# EAGLE design myschem (EAGLE 7.5.0)
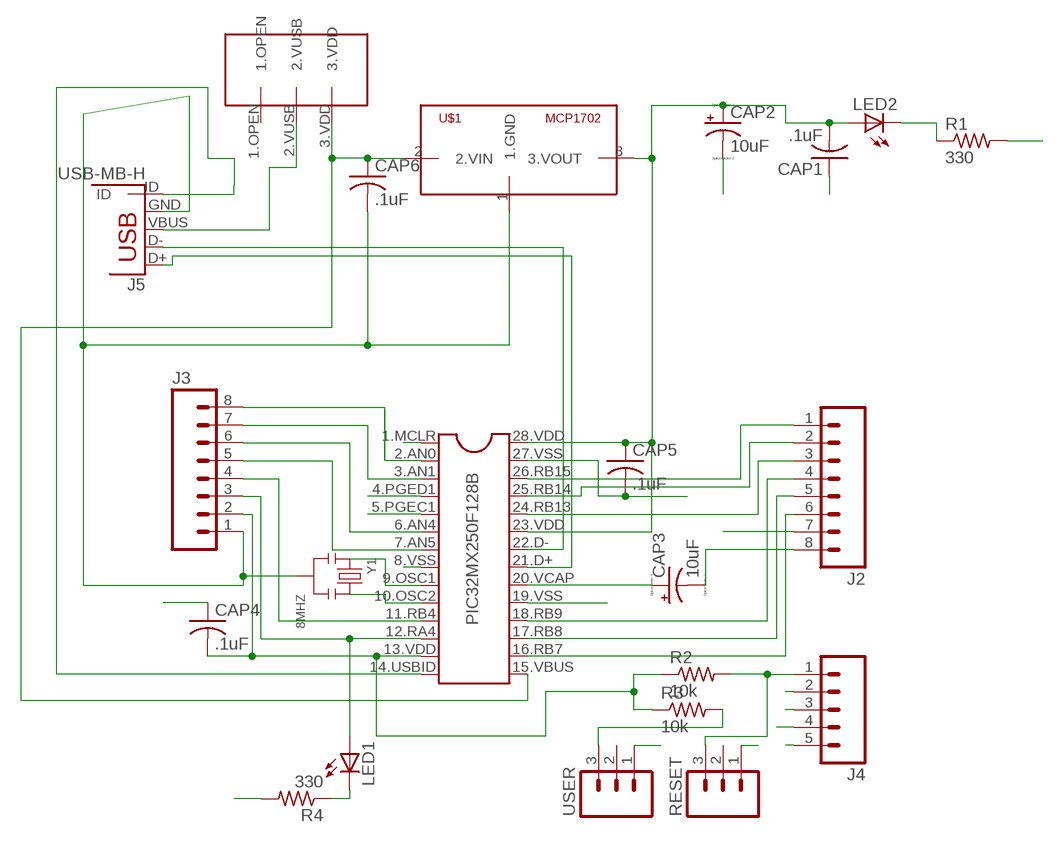
[diagram p0: schematic, sheet 1]

## Parts
CAP1  .1uF  C-US025-024X044  [C025-024X044]
CAP2  10uF  CPOL-USB45181B  [B45181B]
CAP3  10uF  CPOL-USB45181B  [B45181B]
CAP4  .1uF  C-US025-024X044  [C025-024X044]
CAP5  .1uF  C-US025-024X044  [C025-024X044]
CAP6  .1uF  C-US025-024X044  [C025-024X044]
J2  M08  [1X08_ROUND]
J3  M08  [1X08_ROUND]
J4  M05PTH  [1X05]
J5  USB-MB-H  [USB-MB-H]
LED1  LED3MM  [LED3MM]
LED2  LED3MM  [LED3MM]
PIC32MX250F128B  DIL28-3  [DIL28-3]
R1  330  R-US_0207/10  [0207/10]
R2  10k  R-US_0207/10  [0207/10]
R3  10k  R-US_0207/10  [0207/10]
R4  330  R-US_0207/10  [0207/10]
RESET  M03PTH  [1X03]
U$1  MCP1702  [TO92]
U$2  SLIDE-SWTICH  [SLIDE-SWITCH]
USER  M03PTH  [1X03]
Y1  8MHZ  DIP-CERAMIC-RESONATOR/-OSCILLATOR-8MHZ(3P-2.5-8X3MM)  [X3-2.5-8X3X5.5MM]

## Nets
GND: CAP1.1 CAP2.- CAP3.- CAP4.1 CAP5.2 CAP6.2 J2.8 J3.1 J4.3 J5.GND PIC32MX250F128B.8.VSS PIC32MX250F128B.19.VSS PIC32MX250F128B.27.VSS R1.2 R4.2 RESET.1 U$1.1(1.GND) USER.1 Y1.2
MCLR: J4.1 PIC32MX250F128B.1.MCLR R2.2 RESET.3
N$1: J3.8 PIC32MX250F128B.2.AN0
N$2: J3.7 PIC32MX250F128B.3.AN1
N$3: J3.6 PIC32MX250F128B.6.AN4
N$4: J3.5 PIC32MX250F128B.7.AN5
N$5: J5.D- PIC32MX250F128B.22.D-
N$6: J5.D+ PIC32MX250F128B.21.D+
N$7: J3.3 LED1.A PIC32MX250F128B.12.RA4
N$8: J5.ID PIC32MX250F128B.14.USBID
N$9: PIC32MX250F128B.9.OSC1 Y1.1
N$10: PIC32MX250F128B.10.OSC2 Y1.3
N$11: LED2.K(C) R1.1
N$12: J5.VBUS U$2.2.VUSB
N$14: J2.6 PIC32MX250F128B.16.RB7
N$15: LED1.K(C) R4.1
N$17: J2.1 PIC32MX250F128B.26.RB15
N$18: J2.2 PIC32MX250F128B.25.RB14
N$19: J2.3 PIC32MX250F128B.24.RB13
N$20: J2.4 PIC32MX250F128B.18.RB9
N$21: J2.5 PIC32MX250F128B.17.RB8
N$22: CAP3.+ PIC32MX250F128B.20.VCAP
PGEC1: J4.5 PIC32MX250F128B.5.PGEC1
PGED1: J4.4 PIC32MX250F128B.4.PGED1
USER: J3.4 PIC32MX250F128B.11.RB4 R3.2 USER.3
VBUS: CAP6.1 J2.7 PIC32MX250F128B.15.VBUS U$1.2(2.VIN) U$2.3.VDD
VDD: CAP1.2 CAP2.+ CAP4.2 CAP5.1 J3.2 J4.2 LED2.A PIC32MX250F128B.13.VDD PIC32MX250F128B.23.VDD PIC32MX250F128B.28.VDD R2.1 R3.1 U$1.3(3.VOUT)
Unconnected: RESET.2 U$2.1.OPEN USER.2

## Library data of the parts
CAP1 CAP4-CAP6 = mylib:C-US: CAPACITOR, American symbol
CAP2 CAP3 = mylib:CPOL-US: POLARIZED CAPACITOR, American symbol
J2 J3 = mylib:M08: Header 8 Standard 8-pin 0.1" header. Use with straight break away headers (SKU : PRT-00116), right angle break away headers (PRT-00553), swiss pins (PRT-00743), machine pins (PRT-00117), and female headers (PRT-00115).; PROD_ID: CONN-08437
J4 = mylib:M05: Header 5 Standard 5-pin 0.1" header. Use with straight break away headers (SKU : PRT-00116), right angle break away headers (PRT-00553), swiss pins (PRT-00743), machine pins (PRT-00117), and female headers (PRT-00115). Molex polarized connector foot print use with SKU : PRT-08230 with associated crimp pins and housings.
J5 = mylib:USB: USB Connectors USB-B-PTH is fully proven SKU : PRT-00139/CONN-08278 USB-miniB is fully proven SKU : PRT-00587 USB-A-PCB is untested. USB-A-H is throughly reviewed, but untested. Spark Fun Electronics SKU : PRT-00437 USB-B-SMT is throughly reviewed, but untested. Needs silkscreen touching up. USB-A-S has not been used/tested USB-MB-H has not been used/tested USB-MICROB has been used. CONN-09505
LED1 LED2 = mylib:LED: LED OSRAM: - CHIPLED LG R971, LG N971, LY N971, LG Q971, LY Q971, LO R971, LY R971 LH N974, LH R974 LS Q976, LO Q976, LY Q976 LO Q996 - Hyper CHIPLED LW Q18S LB Q993, LB Q99A, LB R99A - SideLED LS A670, LO A670, LY A670, LG A670, LP A670 LB A673, LV A673, LT A673, LW A673 LH A674 LY A675 LS A676, LA A676, LO A676, LY A676, LW A676 LS A679, LY A679, LG A679 - Hyper Micro SIDELED® LS Y876, LA Y876, LO Y876, LY Y876 LT Y87S - SmartLED LW L88C, LW L88S LB L89C, LB L89S, LG L890 LS L89K, LO L89K, LY L89K LS L896, LA L896, LO L896, LY L896 - TOPLED LS T670, LO T670, LY T670, LG T670, LP T670 LSG T670, LSP T670, LSY T670, LOP T670, LYG T670 LG T671, LOG T671, LSG T671 LB T673, LV T673, LT T673, LW T673 LH T674 LS T676, LA T676, LO T676, LY T676, LB T676, LH T676, LSB T676, LW T676 LB T67C, LV T67C, LT T67C, LS T67K, LO T67K, LY T67K, LW E67C LS E67B, LA E67B, LO E67B, LY E67B, LB E67C, LV E67C, LT E67C LW T67C LS T679, LY T679, LG T679 LS T770, LO T770, LY T770, LG T770, LP T770 LB T773, LV T773, LT T773, LW T773 LH T774 LS E675, LA E675, LY E675, LS T675 LS T776, LA T776, LO T776, LY T776, LB T776 LHGB T686 LT T68C, LB T68C - Hyper Mini TOPLED® LB M676 - Mini TOPLED Santana® LG M470 LS M47K, LO M47K, LY M47K Source: http://www.osram.convergy.de LUXEON: - LUMILED® LXK2-PW12-R00, LXK2-PW12-S00, LXK2-PW14-U00, LXK2-PW14-V00 LXK2-PM12-R00, LXK2-PM12-S00, LXK2-PM14-U00 LXK2-PE12-Q00, LXK2-PE12-R00, LXK2-PE12-S00, LXK2-PE14-T00, LXK2-PE14-U00 LXK2-PB12-K00, LXK2-PB12-L00, LXK2-PB12-M00, LXK2-PB14-N00, LXK2-PB14-P00, LXK2-PB14-Q00 LXK2-PR12-L00, LXK2-PR12-M00, LXK2-PR14-Q00, LXK2-PR14-R00 LXK2-PD12-Q00, LXK2-PD12-R00, LXK2-PD12-S00 LXK2-PH12-R00, LXK2-PH12-S00 LXK2-PL12-P00, LXK2-PL12-Q00, LXK2-PL12-R00 Source: www.luxeon.com KINGBRIGHT: KA-3528ASYC Source: www.kingbright.com
PIC32MX250F128B = mylib:DIL28: Dual In Line
R1-R4 = mylib:R-US_: RESISTOR, American symbol
RESET USER = mylib:M03: Header 3 Standard 3-pin 0.1" header. Use with straight break away headers (SKU : PRT-00116), right angle break away headers (PRT-00553), swiss pins (PRT-00743), machine pins (PRT-00117), and female headers (PRT-00115). Molex polarized connector foot print use with SKU : PRT-08232 with associated crimp pins and housings.
U$1 = mylib:MCP1702
U$2 = mylib:SLIDE-SWTICH
Y1 = mylib:DIP-CERAMIC-RESONATOR/-OSCILLATOR-8MHZ(3P-2.5-8X3MM): 306030010; MPN: CSTLS8M00G53Z-A0

## Board
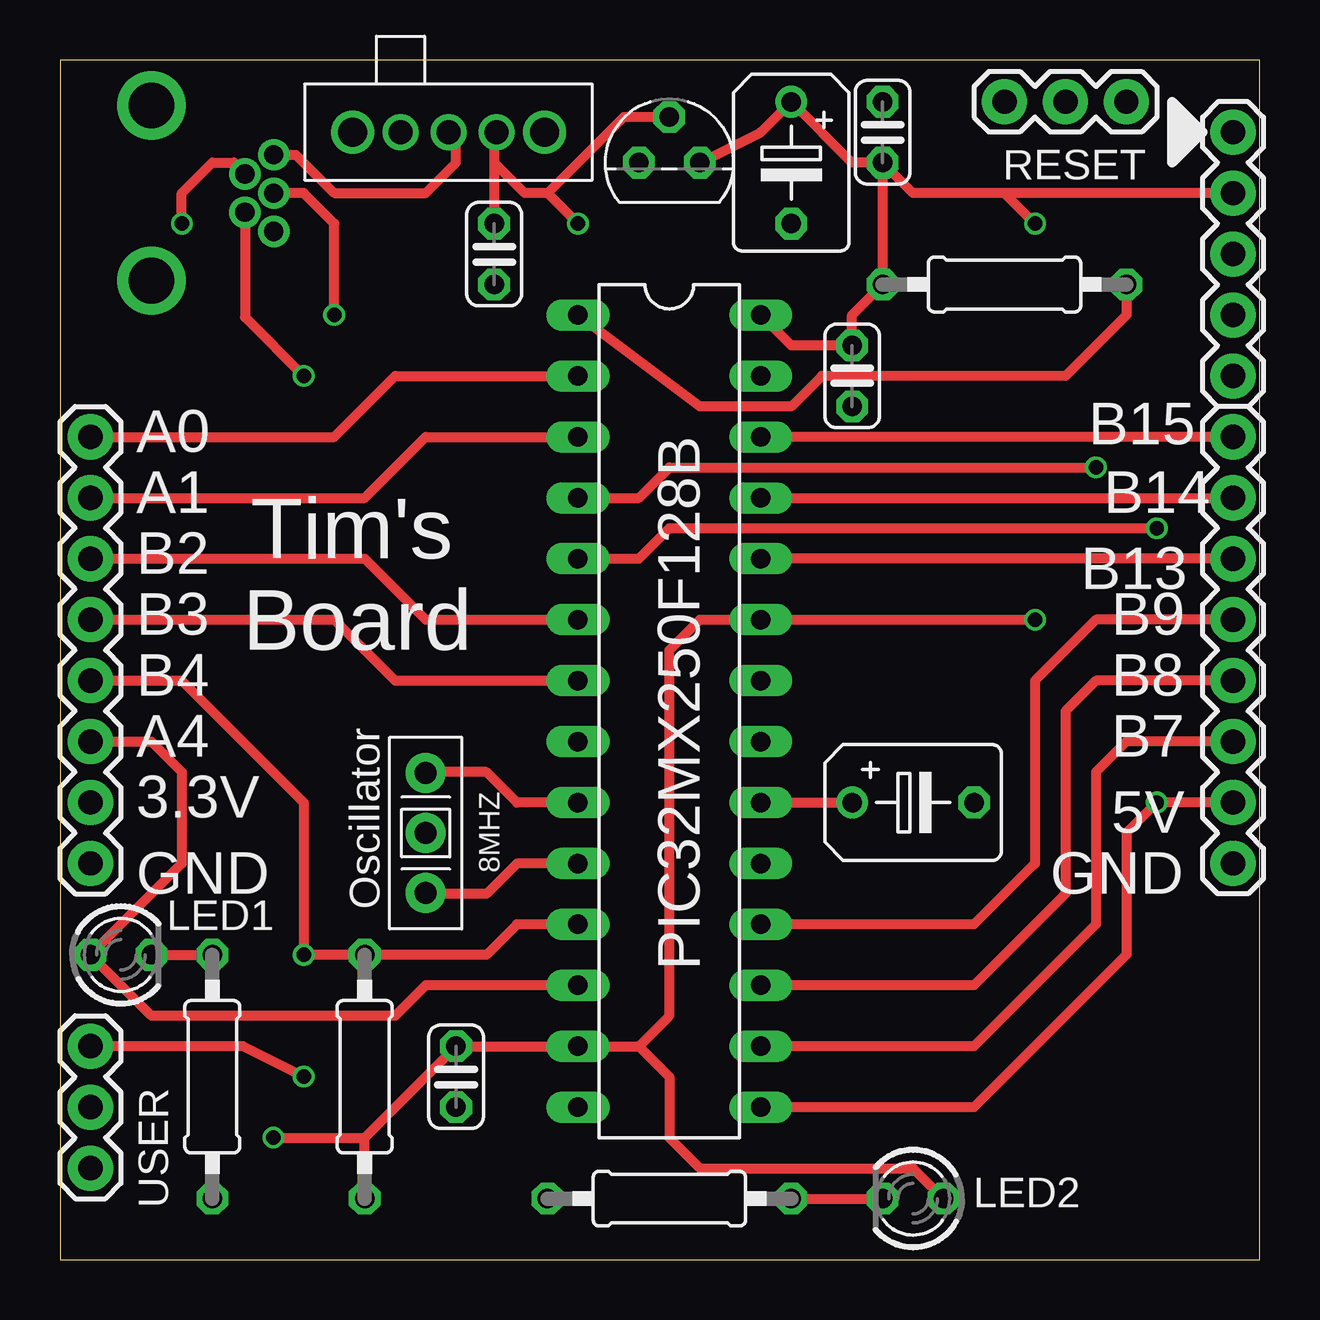
[diagram p1: board, top side]
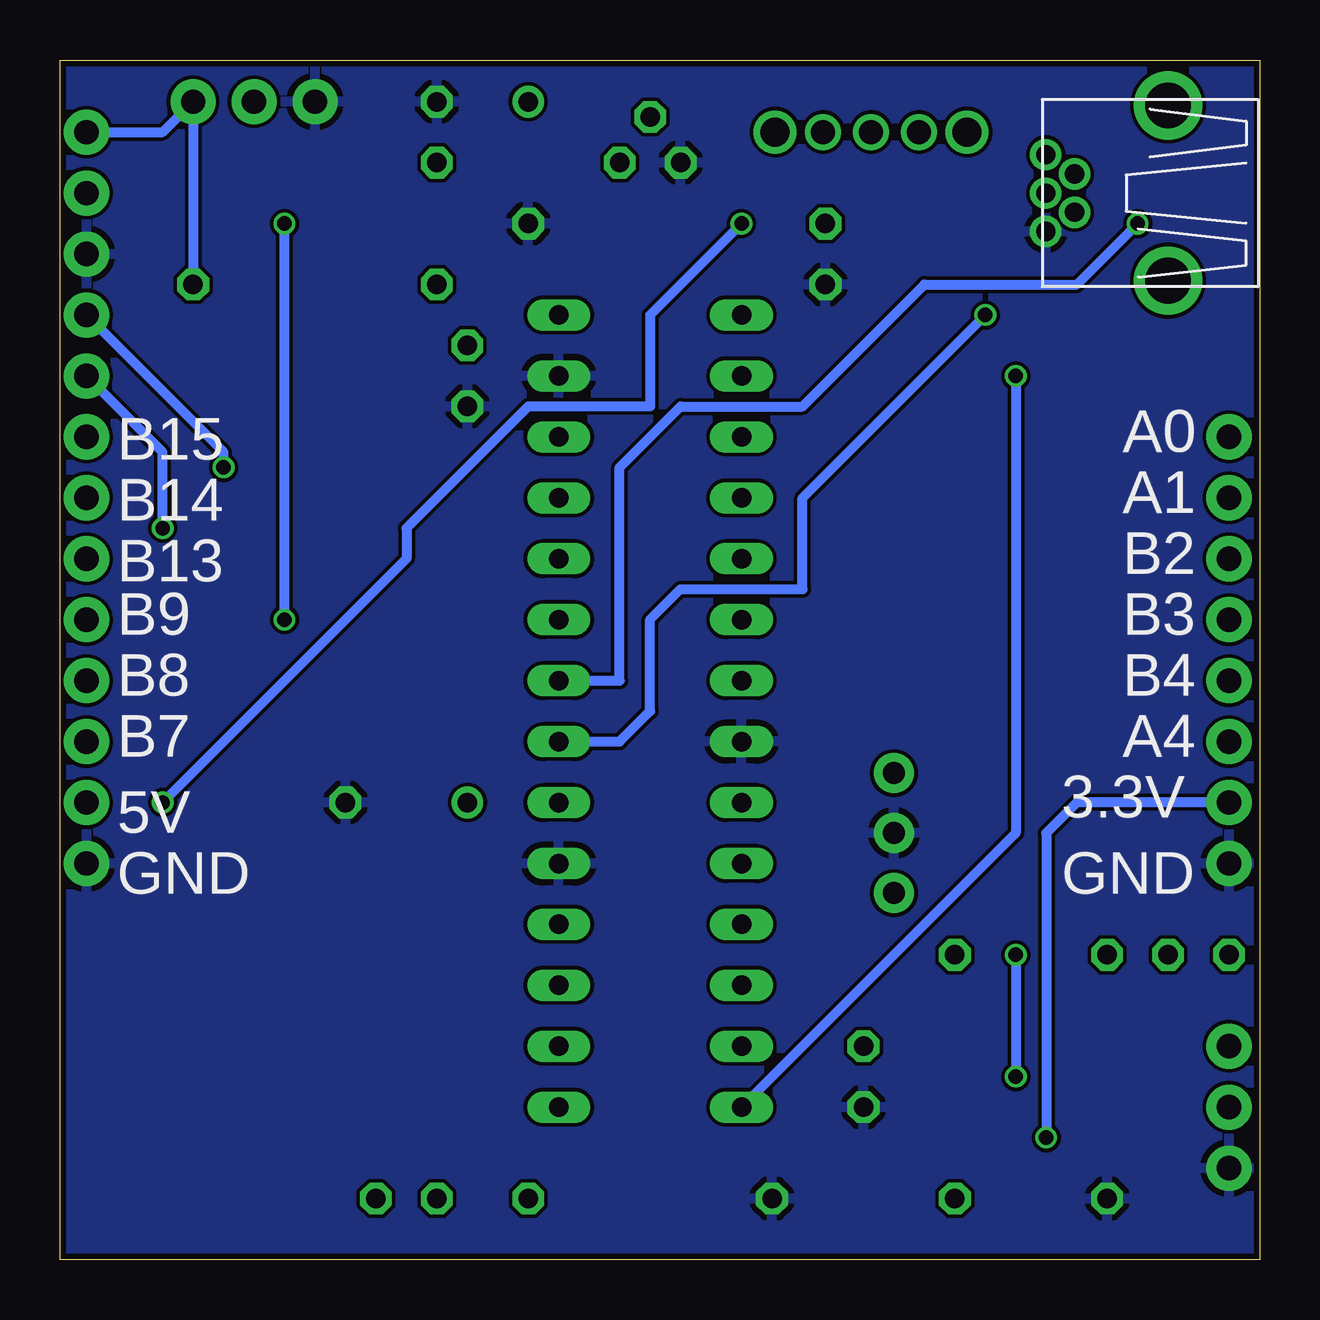
[diagram p2: board, bottom side, seen from below]

Size 50 x 50 mm. Coordinates in mm from the lower left corner, seen from the top.
Outline: 0,0 50,0 50,50 0,50 0,0
Copper layers (1*16): Top 0.035mm / dielectric 1.5mm / Bottom 0.035mm
Design rules "SeeedStudio_2layer_DRU_no_angle_20140221": minimum track width 6mil, minimum drill 12mil, track to track 6mil, track to pad 6mil, pad to pad 6mil, via to via 6mil, smd to smd 0mil, copper to edge 10mil, drill to drill 10mil, minimum pad ring 10mil, minimum via ring 6mil, stop-mask expansion 2mil, vias tented up to drill 100mil, thermal gap 10mil

### Footprints (pad centres in the part's own frame; a part is rotated, then mirrored left to right if it is on the bottom)
C025-024X044 = drill 0.813 octagon: 1 -1.27,0; 2 1.27,0
B45181B = drill 0.813: + -2.54,0 | drill 0.813 octagon: - 2.54,0
1X08_ROUND = drill 1.016 pad 1.88: 1 0,0; 2 2.54,0; 3 5.08,0; 4 7.62,0; 5 10.16,0; 6 12.7,0; 7 15.24,0; 8 17.78,0
1X05 = drill 1.016 pad 1.88: 1 0,0; 2 2.54,0; 3 5.08,0; 4 7.62,0; 5 10.16,0
USB-MB-H = drill 0.8: D+ 5.1,0; D- 3.9,0.8; GND 5.1,-1.6; ID 3.9,-0.8; VBUS 5.1,1.6 | drill 1.9: P$6 0,-3.65; P$7 0,3.65
LED3MM = drill 0.813 octagon: A -1.27,0; K 1.27,0
DIL28-3 = drill 0.813 long: 1.MCLR -16.51,-3.81; 2.AN0 -13.97,-3.81; 3.AN1 -11.43,-3.81; 4.PGED1 -8.89,-3.81; 5.PGEC1 -6.35,-3.81; 6.AN4 -3.81,-3.81; 7.AN5 -1.27,-3.81; 8.VSS 1.27,-3.81; 9.OSC1 3.81,-3.81; 10.OSC2 6.35,-3.81; 11.RB4 8.89,-3.81; 12.RA4 11.43,-3.81; 13.VDD 13.97,-3.81; 14.USBID 16.51,-3.81; 15.VBUS 16.51,3.81; 16.RB7 13.97,3.81; 17.RB8 11.43,3.81; 18.RB9 8.89,3.81; 19.VSS 6.35,3.81; 20.VCAP 3.81,3.81; 21.D+ 1.27,3.81; 22.D- -1.27,3.81; 23.VDD -3.81,3.81; 24.RB13 -6.35,3.81; 25.RB14 -8.89,3.81; 26.RB15 -11.43,3.81; 27.VSS -13.97,3.81; 28.VDD -16.51,3.81
0207/10 = drill 0.813 octagon: 1 -5.08,0; 2 5.08,0
1X03 = drill 1.016 pad 1.88: 1 0,0; 2 2.54,0; 3 5.08,0
TO92 = drill 0.813 octagon: 1 -1.27,0; 2 0,1.905; 3 1.27,0
SLIDE-SWITCH = drill 1: 1.OPEN -2,0; 2.VUSB 0,0; 3.VDD 2,0 | drill 1.2: P$2 4,0; P$5 -4,0
X3-2.5-8X3X5.5MM = drill 0.9 pad 1.676: 1 2.5,0; 2 0,0; 3 -2.5,0

### Placement (x,y rotation side)
CAP1  33.02,36.83 90 top
CAP2  30.48,45.72 270 top
CAP3  35.56,19.05 0 top
CAP4  34.29,46.99 270 top
CAP5  16.51,7.62 270 top
CAP6  18.1,41.91 270 top
J2  48.9,34.29 270 top
J3  1.27,16.51 90 top
J4  48.9,46.99 270 top
J5  3.81,44.45 0 top
LED1  2.54,12.7 0 top
LED2  35.56,2.54 180 top
PIC32MX250F128B  25.4,22.86 270 top
R1  25.4,2.54 180 top
R2  39.37,40.64 0 top
R3  12.7,7.62 90 top
R4  6.35,7.62 270 top
RESET  39.37,48.26 0 top
U$1  25.4,45.72 0 top
U$2  16.19,46.99 0 top
USER  1.27,3.81 90 top
Y1  15.24,17.78 90 top

### Tracks (layer width: path | path; a pad name or v marks a point on that pad's centre or on a via)
GND
  pour Bottom: -2.54,50.8 -2.54,-1.27 52.07,-1.27 52.07,50.8
MCLR
  Top 0.406: R2.2 44.45,39.37 41.91,36.83 31.75,36.83 30.48,35.56 26.67,35.56 PIC32MX250F128B.1.MCLR
  Bottom 0.406: J4.1 45.72,46.99 RESET.3 R2.2
N$1
  Top 0.406: J3.8 11.43,34.29 13.97,36.83 PIC32MX250F128B.2.AN0
N$2
  Top 0.406: J3.7 12.7,31.75 15.24,34.29 PIC32MX250F128B.3.AN1
N$3
  Top 0.406: J3.6 12.7,29.21 15.24,26.67 PIC32MX250F128B.6.AN4
N$4
  Top 0.406: J3.5 11.43,26.67 13.97,24.13 PIC32MX250F128B.7.AN5
N$5  (via drill 0.6)
  Top 0.406: v5.08,43.18 5.08,44.45 6.35,45.72 7.24,45.72 J5.D-
  Bottom 0.406: PIC32MX250F128B.22.D- 26.67,24.13 26.67,33.02 24.13,35.56 19.05,35.56 13.97,40.64 7.62,40.64 v5.08,43.18
N$6  (via drill 0.6)
  Top 0.406: v11.43,39.37 11.43,43.18 10.16,44.45 J5.D+
  Bottom 0.406: PIC32MX250F128B.21.D+ 26.67,21.59 25.4,22.86 25.4,26.67 24.13,27.94 19.05,27.94 19.05,31.75 v11.43,39.37
N$7
  Top 0.406: J3.3 3.81,21.59 5.08,20.32 5.08,16.51 LED1.A 3.81,10.16 13.97,10.16 15.24,11.43 PIC32MX250F128B.12.RA4
N$8  (via drill 0.6)
  Top 0.406: J5.ID 7.71,39.28 v10.16,36.83
  Bottom 0.406: v10.16,36.83 10.16,17.78 PIC32MX250F128B.14.USBID
N$9
  Top 0.406: PIC32MX250F128B.9.OSC1 19.05,19.05 17.78,20.32 15.28,20.32 Y1.1
N$10
  Top 0.406: PIC32MX250F128B.10.OSC2 19.05,16.51 17.78,15.24 15.28,15.24 Y1.3
N$11
  Top 0.406: R1.1 LED2.K
N$12
  Top 0.406: J5.VBUS 9.83,46.05 11.43,44.45 15.24,44.45 16.51,45.72 16.51,46.67 U$2.2.VUSB
N$14
  Top 0.406: J2.6 44.45,21.59 43.18,20.32 43.18,13.97 38.1,8.89 PIC32MX250F128B.16.RB7
N$15
  Top 0.406: LED1.K R4.1
N$17
  Top 0.406: J2.1 PIC32MX250F128B.26.RB15
N$18
  Top 0.406: PIC32MX250F128B.25.RB14 J2.2
N$19
  Top 0.406: J2.3 PIC32MX250F128B.24.RB13
N$20
  Top 0.406: J2.4 43.18,26.67 40.64,24.13 40.64,16.51 38.1,13.97 PIC32MX250F128B.18.RB9
N$21
  Top 0.406: J2.5 43.18,24.13 41.91,22.86 41.91,15.24 38.1,11.43 PIC32MX250F128B.17.RB8
N$22
  Top 0.406: PIC32MX250F128B.20.VCAP CAP3.+
PGEC1  (via drill 0.6)
  Top 0.406: PIC32MX250F128B.5.PGEC1 24.13,29.21 25.4,30.48 v45.72,30.48
  Bottom 0.406: v45.72,30.48 45.72,33.66 J4.5
PGED1  (via drill 0.6)
  Top 0.406: PIC32MX250F128B.4.PGED1 24.13,31.75 25.4,33.02 v43.18,33.02
  Bottom 0.406: v43.18,33.02 43.18,33.66 J4.4
USER  (via drill 0.6)
  Top 0.406: PIC32MX250F128B.11.RB4 19.05,13.97 17.78,12.7 R3.2 v10.16,12.7 10.16,19.05 5.08,24.13 J3.4 | v10.16,7.62 7.62,8.89 USER.3
  Bottom 0.406: v10.16,12.7 v10.16,7.62
VBUS  (via drill 0.6)
  Top 0.406: J2.7 v45.72,19.05 44.45,17.78 44.45,12.7 38.1,6.35 PIC32MX250F128B.15.VBUS | U$2.3.VDD 18.1,46.99 18.1,45.72 | 18.1,45.72 CAP6.1 | U$1.2 23.5,47.62 20.32,44.45 | 20.32,44.45 19.37,44.45 18.1,45.72 | v21.59,43.18 20.32,44.45
  Bottom 0.406: v21.59,43.18 25.4,39.37 25.4,35.56 30.48,35.56 35.56,30.48 35.56,29.21 v45.72,19.05
VDD  (via drill 0.6)
  Top 0.406: R3.1 12.7,5.08 | 12.7,5.08 CAP5.1 PIC32MX250F128B.13.VDD 24.13,8.89 | CAP4.2 R2.1 33.02,39.37 CAP1.2 30.48,38.1 PIC32MX250F128B.28.VDD | J4.2 39.37,44.45 | 39.37,44.45 35.56,44.45 CAP4.2 | U$1.3 29.21,46.99 CAP2.+ 33.02,45.72 CAP4.2 | 24.13,8.89 25.4,7.62 25.4,5.08 26.67,3.81 35.56,3.81 LED2.A | 24.13,8.89 25.4,10.16 25.4,25.4 26.67,26.67 PIC32MX250F128B.23.VDD v40.64,26.67 | v8.89,5.08 12.7,5.08 | v40.64,43.18 39.37,44.45
  Bottom 0.406: J3.2 7.62,19.05 8.89,17.78 v8.89,5.08 | v40.64,26.67 v40.64,43.18

### Text on the board
tPlace: A0 | B15 | A1 | B14 | B2 | Tim's | B13 | B3 | B9 | Board | B4 | B8 | A4 | B7 | 3.3V | 5V | GND | Oscillator | GND | PIC32MX250F128B
bPlace: A0 | B15 | A1 | B14 | B2 | B13 | B3 | B9 | B4 | B8 | A4 | B7 | 3.3V | 5V | GND | GND